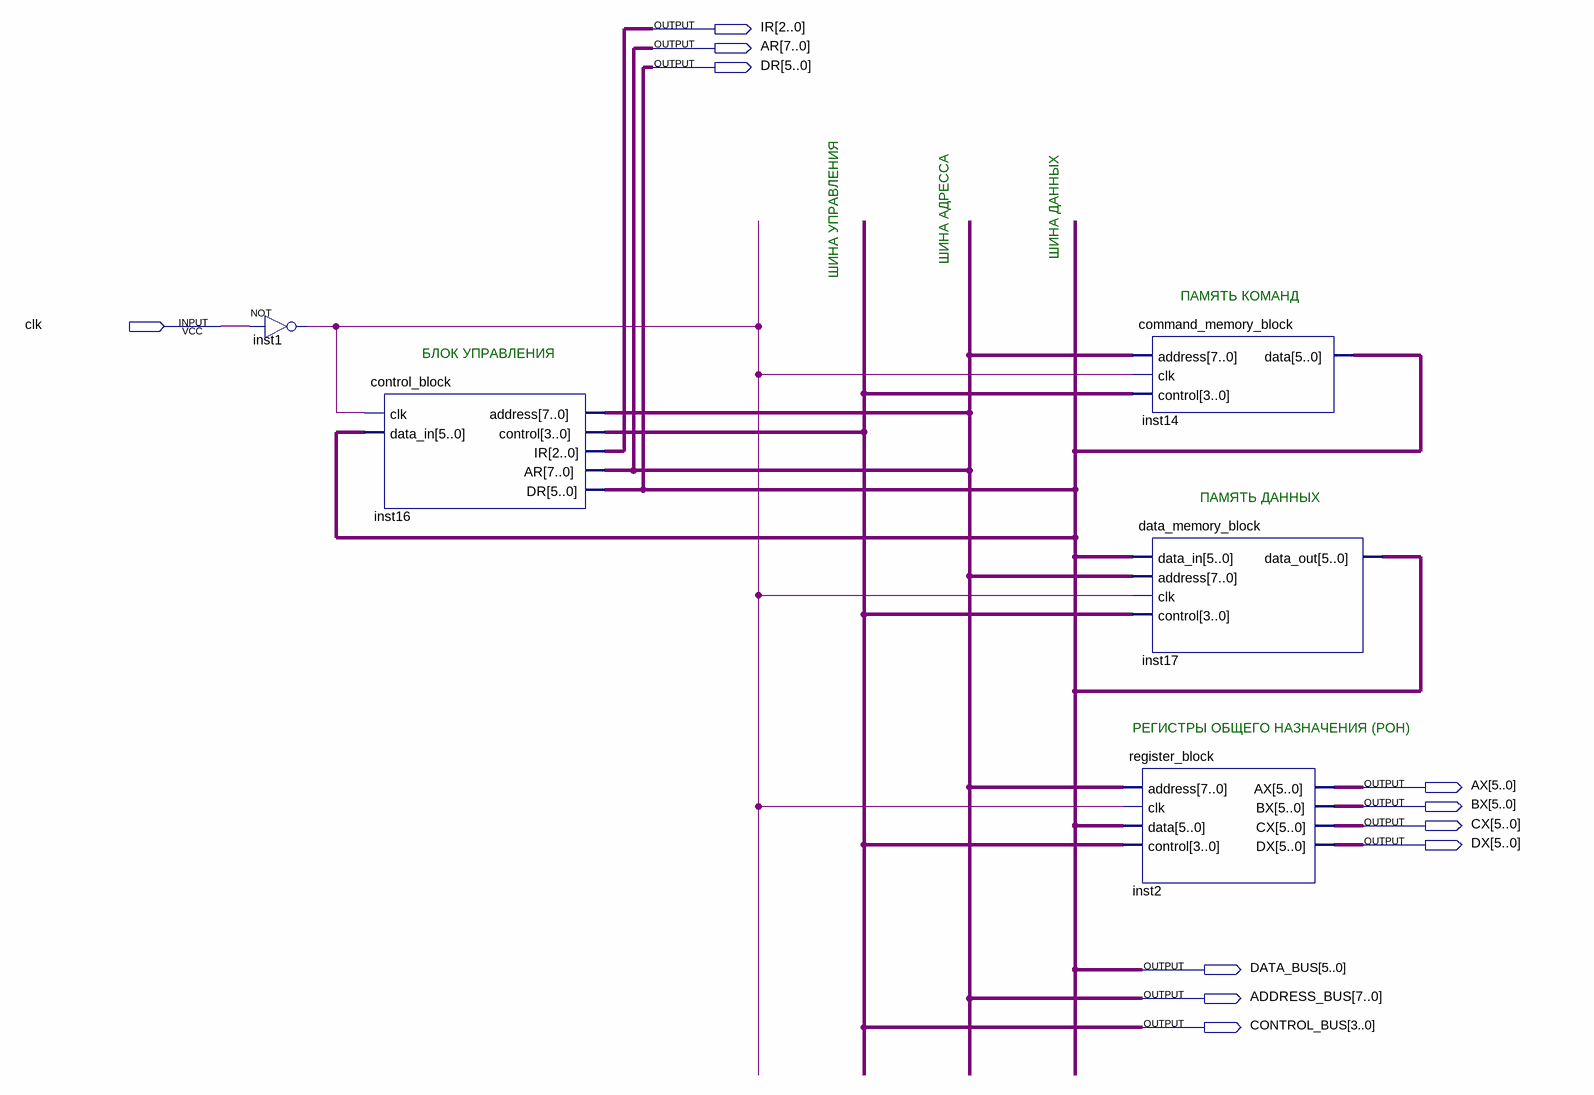
[diagram p0: schematic sheet]
// Quartus schematic main_block.bdf as structural Verilog: 5 symbols, 11 pins
module main_block (
  input  clk,
  output [2:0] IR,
  output [7:0] AR,
  output [5:0] DR,
  output [5:0] AX,
  output [5:0] BX,
  output [5:0] CX,
  output [5:0] DX,
  output [5:0] DATA_BUS,
  output [7:0] ADDRESS_BUS,
  output [3:0] CONTROL_BUS
);

  wire inst1_out;

  not inst1 (inst1_out, clk);
  control_block inst16 (
    .clk(inst1_out), .data_in(DATA_BUS), .address(ADDRESS_BUS), .control(CONTROL_BUS), .IR(IR),
    .AR(ADDRESS_BUS), .DR(DATA_BUS));
  command_memory_block inst14 (.address(ADDRESS_BUS), .clk(inst1_out), .control(CONTROL_BUS), .data(DATA_BUS));
  data_memory_block inst17 (
    .data_in(DATA_BUS), .address(ADDRESS_BUS), .clk(inst1_out), .control(CONTROL_BUS), .data_out(DATA_BUS));
  register_block inst2 (
    .address(ADDRESS_BUS), .clk(inst1_out), .data(DATA_BUS), .control(CONTROL_BUS), .AX(AX), .BX(BX),
    .CX(CX), .DX(DX));

  assign AR = ADDRESS_BUS;
  assign DR = DATA_BUS;

  // Notes on the sheet:
  //   ШИНА УПРАВЛЕНИЯ
  //   ШИНА АДРЕССА
  //   ШИНА ДАННЫХ
  //   ПАМЯТЬ КОМАНД
  //   БЛОК УПРАВЛЕНИЯ
  //   ПАМЯТЬ ДАННЫХ
  //   РЕГИСТРЫ ОБЩЕГО НАЗНАЧЕНИЯ (РОН)
endmodule
